# Altium schematic sheet Connector.SchDoc
size 203 x 193 mm
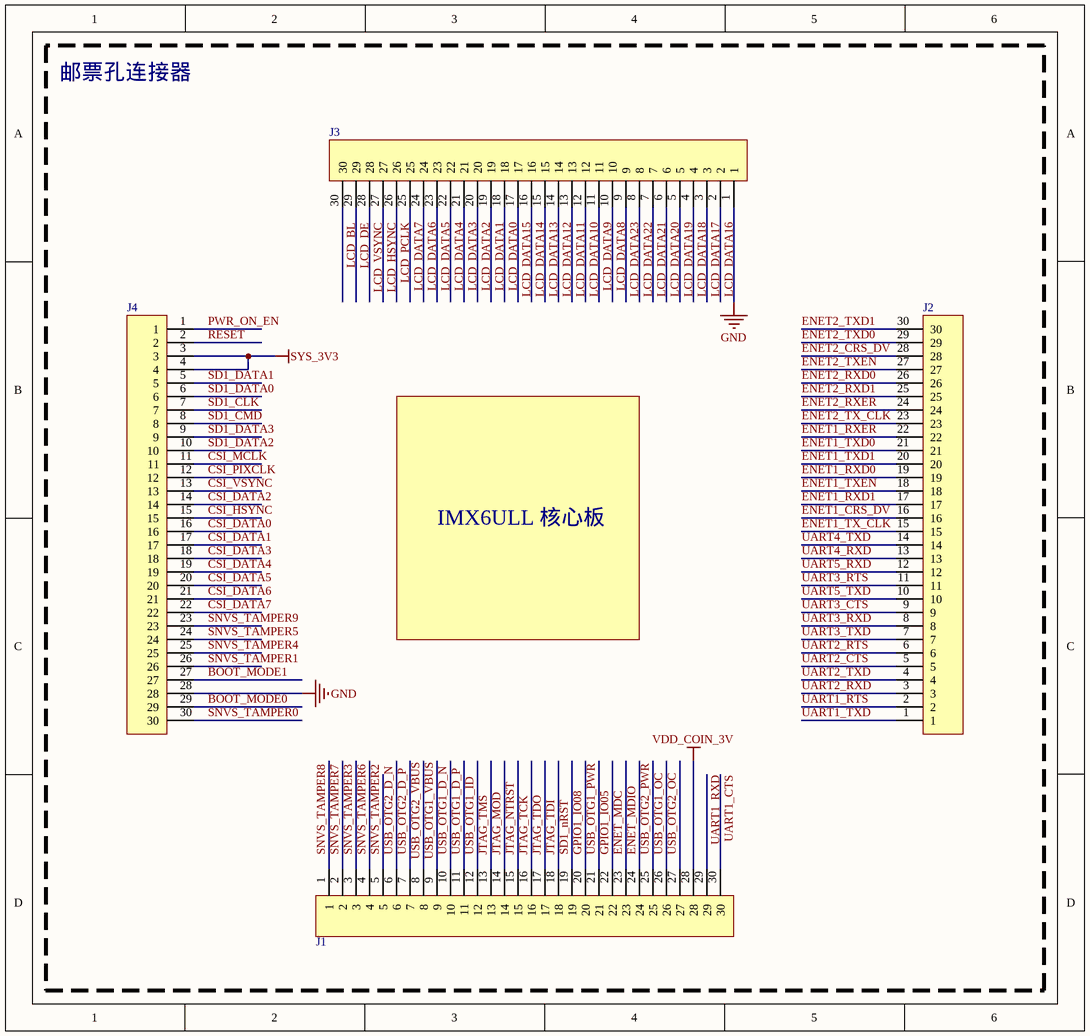
[diagram p0: Connector.SchDoc]

## Parts
J1  stamp_hole_30  [STAMP_HOLE_30]  (value not drawn)
J2  stamp_hole_30  [STAMP_HOLE_30]  (value not drawn)
J3  stamp_hole_30  [STAMP_HOLE_30]  (value not drawn)
J4  stamp_hole_30  [STAMP_HOLE_30]  (value not drawn)

## Nets
GND: J3.1 J4.28
SYS_3V3: J4.3 J4.4
VDD_COIN_3V: J1.28
BOOT_MODE0: J4.29
BOOT_MODE1: J4.27
CSI_DATA0: J4.16
CSI_DATA1: J4.17
CSI_DATA2: J4.14
CSI_DATA3: J4.18
CSI_DATA4: J4.19
CSI_DATA5: J4.20
CSI_DATA6: J4.21
CSI_DATA7: J4.22
CSI_HSYNC: J4.15
CSI_MCLK: J4.11
CSI_PIXCLK: J4.12
CSI_VSYNC: J4.13
ENET1_CRS_DV: J2.16
ENET1_RXD0: J2.19
ENET1_RXD1: J2.17
ENET1_RXER: J2.22
ENET1_TX_CLK: J2.15
ENET1_TXD0: J2.21
ENET1_TXD1: J2.20
ENET1_TXEN: J2.18
ENET2_CRS_DV: J2.28
ENET2_RXD0: J2.26
ENET2_RXD1: J2.25
ENET2_RXER: J2.24
ENET2_TX_CLK: J2.23
ENET2_TXD0: J2.29
ENET2_TXD1: J2.30
ENET2_TXEN: J2.27
ENET_MDC: J1.23
ENET_MDIO: J1.24
GPIO1_IO05: J1.22
GPIO1_IO08: J1.20
JTAG_MOD: J1.14
JTAG_NTRST: J1.15
JTAG_TCK: J1.16
JTAG_TDI: J1.18
JTAG_TDO: J1.17
JTAG_TMS: J1.13
LCD_BL: J3.30
LCD_DATA0: J3.18
LCD_DATA1: J3.19
LCD_DATA2: J3.20
LCD_DATA3: J3.21
LCD_DATA4: J3.22
LCD_DATA5: J3.23
LCD_DATA6: J3.24
LCD_DATA7: J3.25
LCD_DATA8: J3.10
LCD_DATA9: J3.11
LCD_DATA10: J3.12
LCD_DATA11: J3.13
LCD_DATA12: J3.14
LCD_DATA13: J3.15
LCD_DATA14: J3.16
LCD_DATA15: J3.17
LCD_DATA16: J3.2
LCD_DATA17: J3.3
LCD_DATA18: J3.4
LCD_DATA19: J3.5
LCD_DATA20: J3.6
LCD_DATA21: J3.7
LCD_DATA22: J3.8
LCD_DATA23: J3.9
LCD_DE: J3.29
LCD_HSYNC: J3.27
LCD_PCLK: J3.26
LCD_VSYNC: J3.28
PWR_ON_EN: J4.1
RESET: J4.2
SD1_CLK: J4.7
SD1_CMD: J4.8
SD1_DATA0: J4.6
SD1_DATA1: J4.5
SD1_DATA2: J4.10
SD1_DATA3: J4.9
SD1_nRST: J1.19
SNVS_TAMPER0: J4.30
SNVS_TAMPER1: J4.26
SNVS_TAMPER2: J1.5
SNVS_TAMPER3: J1.3
SNVS_TAMPER4: J4.25
SNVS_TAMPER5: J4.24
SNVS_TAMPER6: J1.4
SNVS_TAMPER7: J1.2
SNVS_TAMPER8: J1.1
SNVS_TAMPER9: J4.23
UART1_CTS: J1.30
UART1_RTS: J2.2
UART1_RXD: J1.29
UART1_TXD: J2.1
UART2_CTS: J2.5
UART2_RTS: J2.6
UART2_RXD: J2.3
UART2_TXD: J2.4
UART3_CTS: J2.9
UART3_RTS: J2.11
UART3_RXD: J2.8
UART3_TXD: J2.7
UART4_RXD: J2.13
UART4_TXD: J2.14
UART5_RXD: J2.12
UART5_TXD: J2.10
USB_OTG1_D_N: J1.10
USB_OTG1_D_P: J1.11
USB_OTG1_ID: J1.12
USB_OTG1_OC: J1.26
USB_OTG1_PWR: J1.21
USB_OTG1_VBUS: J1.9
USB_OTG2_D_N: J1.6
USB_OTG2_D_P: J1.7
USB_OTG2_OC: J1.27
USB_OTG2_PWR: J1.25
USB_OTG2_VBUS: J1.8

## Notes on the sheet
- 邮票孔连接器
- IMX6ULL 核心板